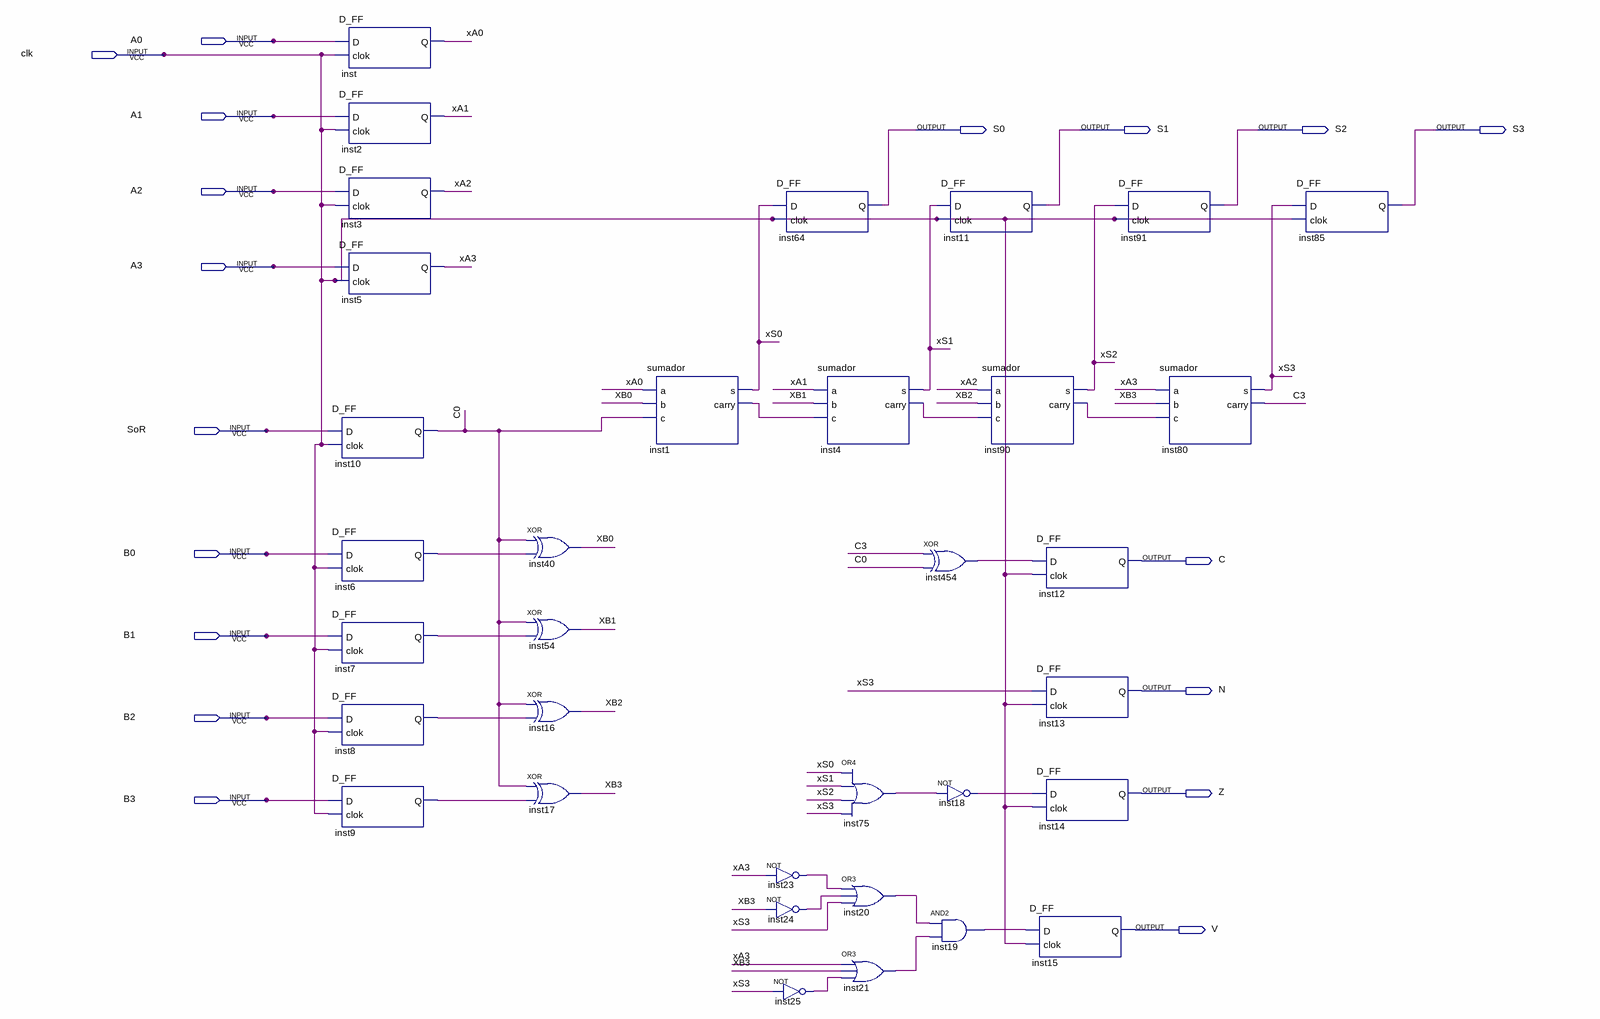
[diagram p0: schematic sheet]
// Quartus schematic EjercicioC.bdf as structural Verilog: 34 symbols, 18 pins
module EjercicioC (
  input  A0,
  input  clk,
  input  A1,
  input  A2,
  input  A3,
  input  SoR,
  input  B0,
  input  B1,
  input  B2,
  input  B3,
  output S0,
  output S1,
  output S2,
  output S3,
  output C,
  output N,
  output Z,
  output V
);

  wire C0, C3, inst1_carry, inst4_carry, inst6_q, inst7_q, inst8_q, inst9_q, inst18_out, inst19_out,
       inst20_out, inst21_out, inst23_out, inst24_out, inst25_out, inst75_out, inst90_carry, inst454_out,
       xA0, xA1, xA2, xA3, XB0, XB1, XB2, XB3, xS0, xS1, xS2, xS3;

  D_FF inst (.D(A0), .clok(clk), .Q(xA0));
  D_FF inst2 (.D(A1), .clok(clk), .Q(xA1));
  D_FF inst3 (.D(A2), .clok(clk), .Q(xA2));
  D_FF inst5 (.D(A3), .clok(clk), .Q(xA3));
  D_FF inst10 (.D(SoR), .clok(clk), .Q(C0));
  D_FF inst6 (.D(B0), .clok(clk), .Q(inst6_q));
  D_FF inst7 (.D(B1), .clok(clk), .Q(inst7_q));
  D_FF inst8 (.D(B2), .clok(clk), .Q(inst8_q));
  D_FF inst9 (.D(B3), .clok(clk), .Q(inst9_q));
  xor inst40 (XB0, C0, inst6_q);
  xor inst54 (XB1, C0, inst7_q);
  xor inst16 (XB2, C0, inst8_q);
  xor inst17 (XB3, C0, inst9_q);
  sumador inst1 (.a(xA0), .b(XB0), .c(C0), .s(xS0), .carry(inst1_carry));
  D_FF inst64 (.D(xS0), .clok(clk), .Q(S0));
  not inst23 (inst23_out, xA3);
  not inst24 (inst24_out, XB3);
  not inst25 (inst25_out, xS3);
  sumador inst4 (.a(xA1), .b(XB1), .c(inst1_carry), .s(xS1), .carry(inst4_carry));
  or inst75 (inst75_out, xS0, xS1, xS2, xS3);
  or inst20 (inst20_out, inst23_out, inst24_out, xS3);
  or inst21 (inst21_out, xA3, XB3, inst25_out);
  D_FF inst11 (.D(xS1), .clok(clk), .Q(S1));
  xor inst454 (inst454_out, C3, C0);
  not inst18 (inst18_out, inst75_out);
  and inst19 (inst19_out, inst20_out, inst21_out);
  sumador inst90 (.a(xA2), .b(XB2), .c(inst4_carry), .s(xS2), .carry(inst90_carry));
  D_FF inst15 (.D(inst19_out), .clok(clk), .Q(V));
  D_FF inst12 (.D(inst454_out), .clok(clk), .Q(C));
  D_FF inst13 (.D(xS3), .clok(clk), .Q(N));
  D_FF inst14 (.D(inst18_out), .clok(clk), .Q(Z));
  D_FF inst91 (.D(xS2), .clok(clk), .Q(S2));
  sumador inst80 (.a(xA3), .b(XB3), .c(inst90_carry), .s(xS3), .carry(C3));
  D_FF inst85 (.D(xS3), .clok(clk), .Q(S3));
endmodule
